# Altium schematic sheet MCU.SchDoc: Rückleuchte Highside-Switch
size A3; Date: April '16; Organization: Fachhochschule Aachen; Address1: Fachbereich Elektrotechnik und Informationstechnik; Address2: Eupenerstraße 70; Address3: 52066 Aachen; DocumentNumber: 1; Revision: 01.00; SheetNumber: 1; SheetTotal: 1; ModifiedDate: 29.04.1026; ProjectName: SIK Praktikum
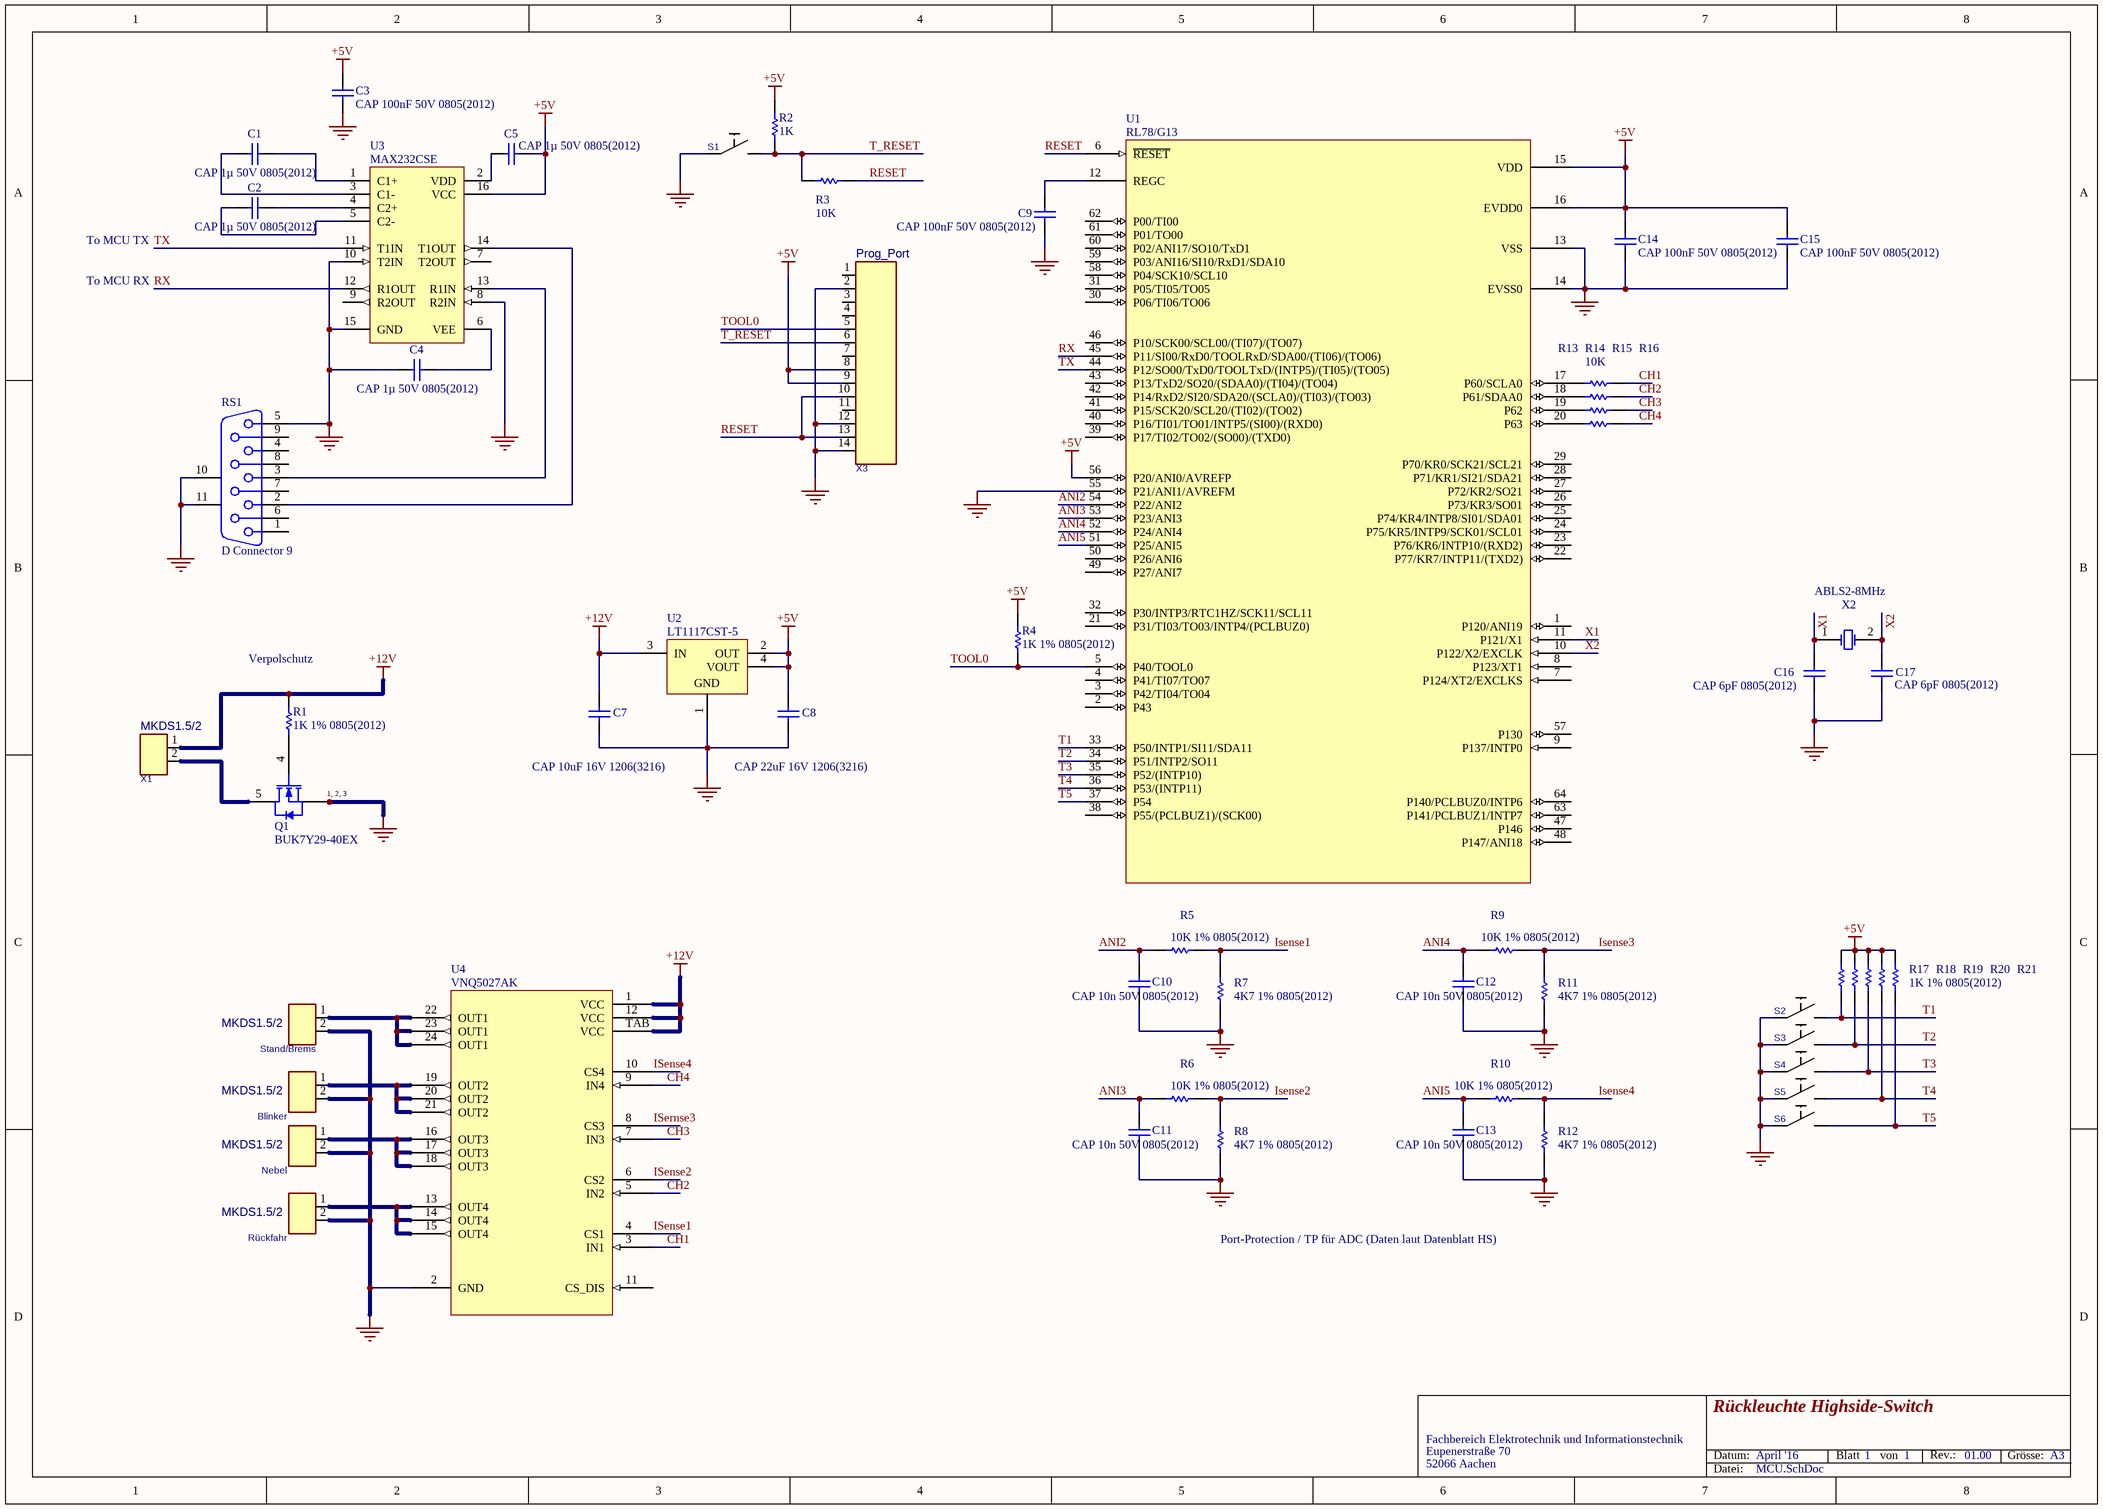
[diagram p0: MCU.SchDoc]

## Parts
Blinker  MKDS1.5/2  [003010001]
C1  CAP 1µ 50V 0805(2012)  [CAPC0805(2012)145_M]
C2  CAP 1µ 50V 0805(2012)  [CAPC0805(2012)145_M]
C3  CAP 100nF 50V 0805(2012)  [CAPC0805(2012)145_M]
C4  CAP 1µ 50V 0805(2012)  [CAPC0805(2012)145_M]
C5  CAP 1µ 50V 0805(2012)  [CAPC0805(2012)145_M]
C7  CAP 10uF 16V 1206(3216)  [CAPC1206(3216)190_L]
C8  CAP 22uF 16V 1206(3216)  [CAPC1206(3216)190_N]
C9  CAP 100nF 50V 0805(2012)  [CAPC0805(2012)145_M]
C10  CAP 10n 50V 0805(2012)  [CAPC0805(2012)145_M]
C11  CAP 10n 50V 0805(2012)  [CAPC0805(2012)145_M]
C12  CAP 10n 50V 0805(2012)  [CAPC0805(2012)145_M]
C13  CAP 10n 50V 0805(2012)  [CAPC0805(2012)145_M]
C14  CAP 100nF 50V 0805(2012)  [CAPC0805(2012)145_M]
C15  CAP 100nF 50V 0805(2012)  [CAPC0805(2012)145_M]
C16  CAP 6pF 0805(2012)  [CAPC0805(2012)145_M]
C17  CAP 6pF 0805(2012)  [CAPC0805(2012)145_M]
Nebel  MKDS1.5/2  [003010001]
Q1  BUK7Y29-40EX  [NXP-SOT669_N]
R1  1K 1% 0805(2012)  [RESC0805(2012)_M]
R2  1K  [RESC0805(2012)_M]
R3  10K  [RESC0805(2012)_M]
R4  1K 1% 0805(2012)  [RESC0805(2012)_M]
R5  10K 1% 0805(2012)  [RESC0805(2012)_M]
R6  10K 1% 0805(2012)  [RESC0805(2012)_M]
R7  4K7 1% 0805(2012)  [RESC0805(2012)_M]
R8  4K7 1% 0805(2012)  [RESC0805(2012)_M]
R9  10K 1% 0805(2012)  [RESC0805(2012)_M]
R10  10K 1% 0805(2012)  [RESC0805(2012)_M]
R11  4K7 1% 0805(2012)  [RESC0805(2012)_M]
R12  4K7 1% 0805(2012)  [RESC0805(2012)_M]
R13  10K  [RESC0805(2012)_M]
R14  10K  [RESC0805(2012)_M]  (value not drawn)
R15  10K  [RESC0805(2012)_M]  (value not drawn)
R16  10K  [RESC0805(2012)_M]  (value not drawn)
R17  1K 1% 0805(2012)  [RESC0805(2012)_M]
R18  1K 1% 0805(2012)  [RESC0805(2012)_M]  (value not drawn)
R19  1K 1% 0805(2012)  [RESC0805(2012)_M]  (value not drawn)
R20  1K 1% 0805(2012)  [RESC0805(2012)_M]  (value not drawn)
R21  1K 1% 0805(2012)  [RESC0805(2012)_M]  (value not drawn)
RS1  D Connector 9  [DSUB1.385-2H9]
Rückfahr  MKDS1.5/2  [003010001]
S1  DTSM-644K-V-B  [010400001]  (value not drawn)
S2  DTSM-644K-V-B  [010400001]  (value not drawn)
S3  DTSM-644K-V-B  [010400001]  (value not drawn)
S4  DTSM-644K-V-B  [010400001]  (value not drawn)
S5  DTSM-644K-V-B  [010400001]  (value not drawn)
S6  DTSM-644K-V-B  [010400001]  (value not drawn)
Stand/Brems  MKDS1.5/2  [003010001]
U1  RL78/G13
U2  LT1117CST-5  [LT-ST-3-SOT-223_N]
U3  MAX232CSE  [NSO16]
U4  VNQ5027AK
X1  MKDS1.5/2  [003010001]
X2  ABLS2-8MHz  [ABRA-ABLS2-2_V]
X3  Prog_Port  [001000006]

## Nets
+5V: C3.2 C5.1 C8.2 C14.2 C15.2 R2.1 R4.1 R17.1 R18.1 R19.1 R20.1 R21.1 U1.15(VDD) U1.16(EVDD0) U1.56(P20/ANI0/AVREFP) U2.2(OUT) U2.4(VOUT) U3.16(VCC) X3.8 X3.9
+12V: C7.2 R1.1 U2.3(IN) U4.1(VCC) U4.12(VCC) U4.TAB(VCC) X1.1
GND: Blinker.2 C3.1 C4.2 C7.1 C8.1 C9.1 C10.2 C11.2 C12.2 C13.2 C14.1 C15.1 C16.1 C17.1 Nebel.2 Q1.1(S) Q1.2(S) Q1.3(S) R7.1 R8.1 R11.1 R12.1 RS1.5 RS1.10(MH1) RS1.11(MH2) Rückfahr.2 S1.1 S2.1 S3.1 S4.1 S5.1 S6.1 Stand/Brems.2 U1.13(VSS) U1.14(EVSS0) U1.55(P21/ANI1/AVREFM) U2.1(GND) U3.8(R2IN) U3.10(T2IN) U3.15(GND) U4.2(GND) X3.2 X3.12 X3.14
ANI2: C10.1 R5.1 U1.54(P22/ANI2)
ANI3: C11.1 R6.1 U1.53(P23/ANI3)
ANI4: C12.1 R9.1 U1.52(P24/ANI4)
ANI5: C13.1 R10.1 U1.51(P25/ANI5)
CH1: R13.2 U4.3(IN1)
CH2: R14.2 U4.5(IN2)
CH3: R15.2 U4.7(IN3)
CH4: R16.2 U4.9(IN4)
Isense1: R5.2 R7.2 U4.4(CS1)
Isense2: R6.2 R8.2 U4.6(CS2)
Isense3: R9.2 R11.2
Isense4: R10.2 R12.2 U4.10(CS4)
ISernse3: U4.8(CS3)
RESET: R3.2 U1.6(~{RESET}) X3.10 X3.13
RX: U1.45(P11/SI00/RxD0/TOOLRxD/SDA00/(TI06)/(TO06)) U3.12(R1OUT)
T1: R17.2 S2.2 U1.33(P50/INTP1/SI11/SDA11)
T2: R18.2 S3.2 U1.34(P51/INTP2/SO11)
T3: R19.2 S4.2 U1.35(P52/(INTP10))
T4: R20.2 S5.2 U1.36(P53/(INTP11))
T5: R21.2 S6.2 U1.37(P54)
T_RESET: R2.2 R3.1 S1.2 X3.6
TOOL0: R4.2 U1.5(P40/TOOL0) X3.5
TX: U1.44(P12/SO00/TxD0/TOOLTxD/(INTP5)/(TI05)/(TO05)) U3.11(T1IN)
X1: C16.2 U1.11(P121/X1) X2.1(X1)
X2: C17.2 U1.10(P122/X2/EXCLK) X2.2(X2)
NetBlinker_1: Blinker.1 U4.19(OUT2) U4.20(OUT2) U4.21(OUT2)
NetC1_1: C1.1 U3.1(C1+)
NetC1_2: C1.2 U3.3(C1-)
NetC2_1: C2.1 U3.4(C2+)
NetC2_2: C2.2 U3.5(C2-)
NetC4_1: C4.1 U3.6(VEE)
NetC5_2: C5.2 U3.2(VDD)
NetC9_2: C9.2 U1.12(REGC)
NetNebel_1: Nebel.1 U4.16(OUT3) U4.17(OUT3) U4.18(OUT3)
NetQ1_4: Q1.4(G) R1.2
NetQ1_5: Q1.5(D) X1.2
NetR13_1: R13.1 U1.17(P60/SCLA0)
NetR14_1: R14.1 U1.18(P61/SDAA0)
NetR15_1: R15.1 U1.19(P62)
NetR16_1: R16.1 U1.20(P63)
NetRS1_2: RS1.2 U3.14(T1OUT)
NetRS1_3: RS1.3 U3.13(R1IN)
NetRückfahr_1: Rückfahr.1 U4.13(OUT4) U4.14(OUT4) U4.15(OUT4)
NetStand/Brems_1: Stand/Brems.1 U4.22(OUT1) U4.23(OUT1) U4.24(OUT1)

Not connected (* = marked no-connect by the designer): RS1 1 4 6 7 8 9; U1 1(P120/ANI19) 2(P43) 3(P42/TI04/TO04) 4(P41/TI07/TO07) 7(P124/XT2/EXCLKS) 8(P123/XT1) 9(P137/INTP0) 21(P31/TI03/TO03/INTP4/(PCLBUZ0)) 22(P77/KR7/INTP11/(TXD2)) 23(P76/KR6/INTP10/(RXD2)) 24(P75/KR5/INTP9/SCK01/SCL01) 25(P74/KR4/INTP8/SI01/SDA01) 26(P73/KR3/SO01) 27(P72/KR2/SO21) 28(P71/KR1/SI21/SDA21) 29(P70/KR0/SCK21/SCL21) 30(P06/TI06/TO06) 31(P05/TI05/TO05) 32(P30/INTP3/RTC1HZ/SCK11/SCL11) 38(P55/(PCLBUZ1)/(SCK00)) 39(P17/TI02/TO02/(SO00)/(TXD0)) 40(P16/TI01/TO01/INTP5/(SI00)/(RXD0)) 41(P15/SCK20/SCL20/(TI02)/(TO02)) 42(P14/RxD2/SI20/SDA20/(SCLA0)/(TI03)/(TO03)) 43(P13/TxD2/SO20/(SDAA0)/(TI04)/(TO04)) 46(P10/SCK00/SCL00/(TI07)/(TO07)) 47(P146) 48(P147/ANI18) 49(P27/ANI7) 50(P26/ANI6) 57(P130) 58(P04/SCK10/SCL10) 59(P03/ANI16/SI10/RxD1/SDA10) 60(P02/ANI17/SO10/TxD1) 61(P01/TO00) 62(P00/TI00) 63(P141/PCLBUZ1/INTP7) 64(P140/PCLBUZ0/INTP6); U3 7(T2OUT) 9(R2OUT); U4 11(CS_DIS); X3 1 3 4 7 11

## Notes on the sheet
- To MCU TX
- To MCU RX
- (near R1) Verpolschutz
- Port-Protection / TP für ADC (Daten laut Datenblatt HS)
- Datum:
- Blatt
- von
- Rev.:
- Grösse:
- A3
- Datei:
- (in symbol CMP-1259-00392-1) 1, 2, 3

## Library data of the parts
Blinker Nebel Rückfahr Stand/Brems X1 = 1000.0654: Printklemme PHOENIX 2pol.; Ordering Code: 141203; SMT: False; Partnum: 1000.0654; Category: Connectors; Supplier: Distrelec; Deleted: False
C1-C5 C9-C17 = CMP-1036-04419-1: CAP 100nF 50V ±10% 0805 (2012 Metric) Thickness 1.45mm SMD; Tolerance: Â±10%; Case-EIA: 0805; Case-Metric: 2012; Rated Voltage: 50 V; Technology: SMT; Max Thickness: 1.45 mm; Value: 100nF
C7 = CMP-1037-04974-1: CAP 10uF 16V ±10% 1206 (3216 Metric) Thickness 1.9mm SMD; Case-EIA: 1206; Case-Metric: 3216; Tolerance: Â±10%; Rated Voltage: 16 V; Max Thickness: 1.9 mm; Value: 10uF; Technology: SMT
C8 = CMP-1037-04992-1: CAP 22uF 16V ±10% 1206 (3216 Metric) Thickness 1.9mm SMD; Case-EIA: 1206; Case-Metric: 3216; Tolerance: Â±10%; Rated Voltage: 16 V; Technology: SMT; Value: 22uF; Max Thickness: 1.9 mm
Q1 = CMP-1259-00392-1: N-Channel Standard Level MOSFET, 40 V, 26 A, 5-Pin SOT669, Tape and Reel; Manufacturer: NXP Semiconductors; VDS [max] (V): 40; IDM [max] (A): 102; Automotive Qualified: Y; ID [max] (A): 26; Channel Type: N; Packing: Tape & Reel; VGSth [typ] (V): 3; Qr [typ] (nC): 6.8; PackageReference: SOT669; PackageVersion: 13-02-27, 02/2013; ComponentLink3URL: http://www.nxp.com/documents/outline_drawing/sot669_po.pdf; ComponentLink1URL: http://www.nxp.com/; ComponentLink3Description: Package Specification; Code_JEDEC: MO-235; ComponentLink1Description: Manufacturer URL; PartNumber: BUK7Y29-40EX; ComponentLink2Description: Datasheet; Mounting Technology: Surface Mount; PackageDescription: 4-Pin Plastic Single-ended Surface Mounted Package, Body 4.9 x 3.95 mm, Pitch 1.27 mm; ComponentLink2URL: http://www.nxp.com/documents/data_sheet/BUK7Y29-40E.pdf
R1-R21 = CMP-1013-00623-1: 10K 0.125W 1% 0805 (2012 Metric)  SMD; Value: 10000.00 Ohm; Case-Metric: 2012; Case-EIA: 0805; Tolerance: 1 %; Power: 0.125 W; Technology: SMT
RS1 = D Connector 9: Receptacle Assembly, 9 Position, Right Angle; Package Information: Latest Revision: O; Positions: 9; Published: 15-Jun-2001; Revision: 17-Jul-2002: Re-released for DXP Platform.; Datasheet: (1-Sep-1999); Package Reference: 788750; Publisher: Altium Limited; Orientation: Right Angle; Gender: Receptacle
S1-S6 = 1000.0493: Drucktaste DTSM-644K-V-B quadratisch; Manufacturer: Diptronics; Ordering Code: 200312; SMT: True; Deleted: False; Partnum: 1000.0493; Category: Switches; ComponentLink1URL: http://www.dip.com.tw/PDF/DTSM(G)-6(2)-V.pdf; ComponentLink1Description: Datasheet; Supplier: Distrelec; Manufacturer Code: DTSM-644K-V-B
U2 = CMP-0476-01813-1: 0.8 A Low Dropout Positive Regulator, 2.45 to 15 V Vin, 5 V Vout, 3-pin SOT223 (ST-3), 0 to 125 degC; Manufacturer: Linear Technology; Vin Max(V): 15; Vin Min(V): 2.45; PSRR(dB): 75; Iout(mA): 800; Output Voltage: 5 V; Number of Outputs: 1; Dropout Voltage(V): 1.1; Isupply(mA): 5; Discrete Pass Element: no; ComponentLink2Description: Datasheet; ComponentLink1URL: http://www.linear.com/; ComponentLink3Description: Package Specification; PackageDescription: 3-Pin Plastic SOT-223, 3.505 x 6.505 mm Body, Pitch 2.3 mm; DatasheetVersion: Rev. D; ComponentLink2URL: http://cds.linear.com/docs/en/datasheet/1117fd.pdf; RoHS: FALSE; Mounting Technology: Surface Mount; ComponentLink1Description: Manufacturer URL; ComponentLink3URL: http://cds.linear.com/docs/en/packaging/SOT_3_05-08-1630.pdf; PartNumber: LT1117CST-5; PackageVersion: Jun-10; PackageReference: ST-3
U3 = MAX232CSE: +5V Powered, Multi-Channel RS-232 Driver/Receiver; Code - JEDEC: MS-012-AC; Code - IPC: SO16; Published: 16-Jan-2001; Revision: 17-Jul-2002: Re-released for DXP Platform.; Package Reference: NSO16; Publisher: Altium Limited
U4 = IR_AUIPS6044G: High Side Switch; PartNr: 511-VNQ5027AKTR-E; Distributor: Mouser
X2 = CMP-0277-00002-1: Low Profile Surface Mount Microprocessor Crystal, 4.096 MHz +/-30 ppm, 180 Ohm, -40 to 85 degC, 2-Pin 11.4 x 4.7 x 3.3 mm SMD, RoHS, Tape and Reel; Manufacturer: Abracon; PartNumber: ABLS2-4.096MHZ-D4Y-T; Operation Mode: Fundamental or 3rd Overtone; Shunt Capacitance: 7 pF Max.; ESR: 180 Ohm; Load Capacitance: 18 pF; Mounting Technology: Surface Mount; PackageDescription: 2-Pin SMD, Body 11.4 x 4.7 mm, Height 3.3 mm; ComponentLink1URL: http://www.abracon.com/; Freq. Stability: +/- 30 ppm; ComponentLink2Description: Datasheet; Operating Temp. Range: -40 to 85 degC; Packing: Tape and Reel; RoHS: TRUE; PackageReference: ABLS2-2; DatasheetVersion: Rev. 03.31.11; Freq. Tolerance: +/- 30 ppm; Frequency: 4.096 MHz; ComponentLink2URL: http://www.abracon.com/Resonators/ABLS2.pdf; ComponentLink1Description: Manufacturer URL
X3 = 1000.0501: Stiftleiste 2 x 7; SMT: False; Partnum: 1000.0501; Category: Connectors; Ordering Code: CON14A; Deleted: False